# EasyEDA Pro project ProDoc_P2_2025-09-22.epro

# Schematic Schematic3
Board Name: 处理器; Create Date: 2024-10-06; Page Name: P2; Project Name: 八通道接口; Schematic Name: Schematic3; Update Date: 2024-10-06; Company: 嘉立创EDA; Page Size: B; Version: V1.0
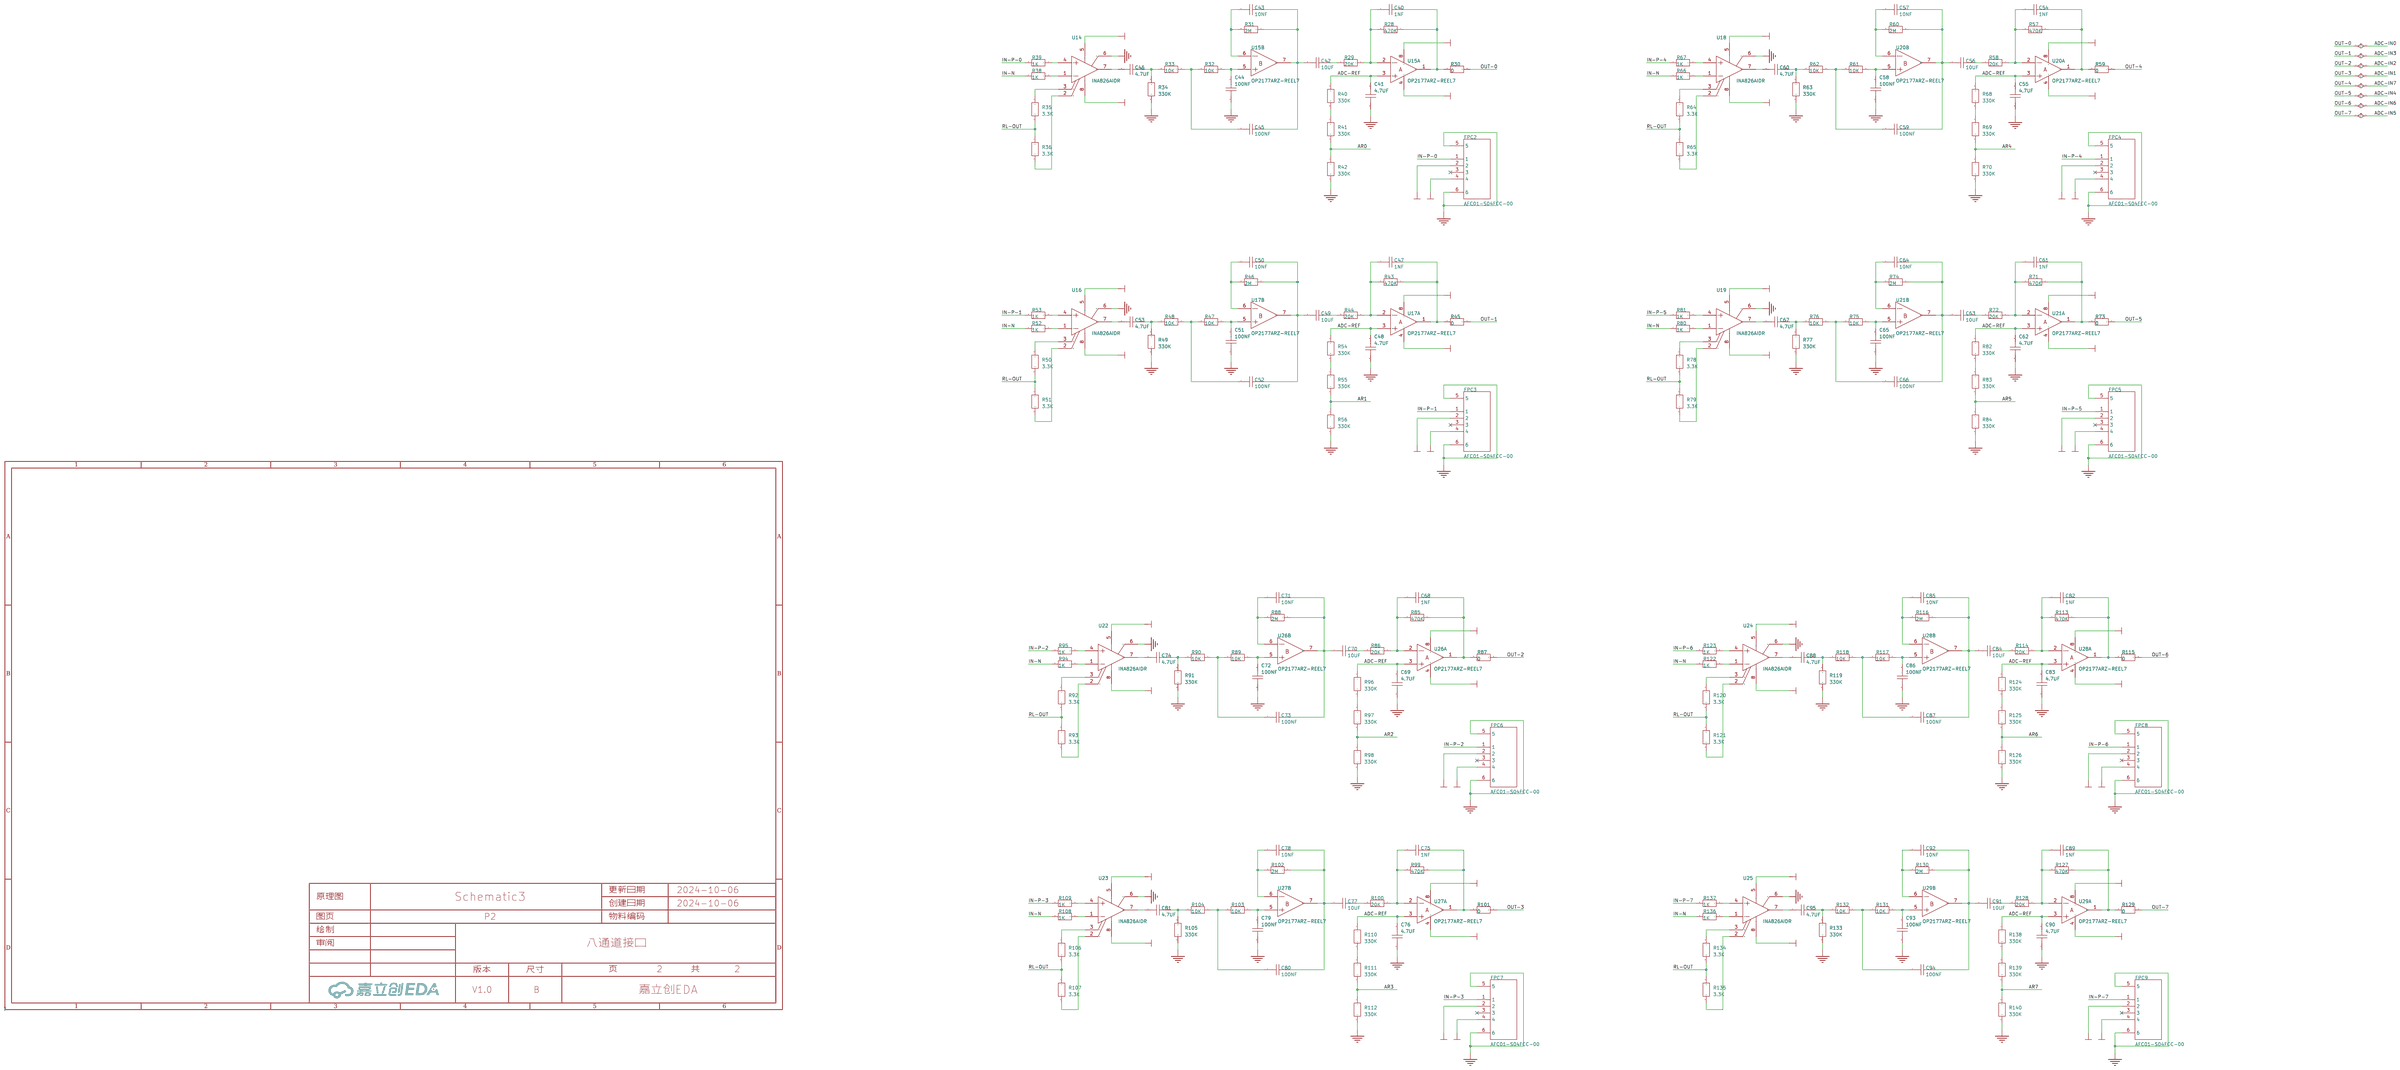
[diagram p0: schematic sheet]

## Parts
C40  1NF  [C0603]
C41  4.7UF  [C0603]
C42  10UF  [C0603]
C43  10NF  [C0603]
C44  100NF  [C0603]
C45  100NF  [C0603]
C46  4.7UF  [C0603]
C47  1NF  [C0603]
C48  4.7UF  [C0603]
C49  10UF  [C0603]
C50  10NF  [C0603]
C51  100NF  [C0603]
C52  100NF  [C0603]
C53  4.7UF  [C0603]
C54  1NF  [C0603]
C55  4.7UF  [C0603]
C56  10UF  [C0603]
C57  10NF  [C0603]
C58  100NF  [C0603]
C59  100NF  [C0603]
C60  4.7UF  [C0603]
C61  1NF  [C0603]
C62  4.7UF  [C0603]
C63  10UF  [C0603]
C64  10NF  [C0603]
C65  100NF  [C0603]
C66  100NF  [C0603]
C67  4.7UF  [C0603]
C68  1NF  [C0603]
C69  4.7UF  [C0603]
C70  10UF  [C0603]
C71  10NF  [C0603]
C72  100NF  [C0603]
C73  100NF  [C0603]
C74  4.7UF  [C0603]
C75  1NF  [C0603]
C76  4.7UF  [C0603]
C77  10UF  [C0603]
C78  10NF  [C0603]
C79  100NF  [C0603]
C80  100NF  [C0603]
C81  4.7UF  [C0603]
C82  1NF  [C0603]
C83  4.7UF  [C0603]
C84  10UF  [C0603]
C85  10NF  [C0603]
C86  100NF  [C0603]
C87  100NF  [C0603]
C88  4.7UF  [C0603]
C89  1NF  [C0603]
C90  4.7UF  [C0603]
C91  10UF  [C0603]
C92  10NF  [C0603]
C93  100NF  [C0603]
C94  100NF  [C0603]
C95  4.7UF  [C0603]
FPC2  AFC01-S04FCC-00  [FFC-SMD_4P-P0.50_AFC01-S04FCC-00]
FPC3  AFC01-S04FCC-00  [FFC-SMD_4P-P0.50_AFC01-S04FCC-00]
FPC4  AFC01-S04FCC-00  [FFC-SMD_4P-P0.50_AFC01-S04FCC-00]
FPC5  AFC01-S04FCC-00  [FFC-SMD_4P-P0.50_AFC01-S04FCC-00]
FPC6  AFC01-S04FCC-00  [FFC-SMD_4P-P0.50_AFC01-S04FCC-00]
FPC7  AFC01-S04FCC-00  [FFC-SMD_4P-P0.50_AFC01-S04FCC-00]
FPC8  AFC01-S04FCC-00  [FFC-SMD_4P-P0.50_AFC01-S04FCC-00]
FPC9  AFC01-S04FCC-00  [FFC-SMD_4P-P0.50_AFC01-S04FCC-00]
R28  470K  [R0603]
R29  20K  [R0603]
R30  0  [R0603]
R31  2M  [R0603]
R32  10K  [R0603]
R33  10K  [R0603]
R34  330K  [R0603]
R35  3.3K  [R0603]
R36  3.3K  [R0603]
R38  1K  [R0603]
R39  1K  [R0603]
R40  330K  [R0603]
R41  330K  [R0603]
R42  330K  [R0603]
R43  470K  [R0603]
R44  20K  [R0603]
R45  0  [R0603]
R46  2M  [R0603]
R47  10K  [R0603]
R48  10K  [R0603]
R49  330K  [R0603]
R50  3.3K  [R0603]
R51  3.3K  [R0603]
R52  1K  [R0603]
R53  1K  [R0603]
R54  330K  [R0603]
R55  330K  [R0603]
R56  330K  [R0603]
R57  470K  [R0603]
R58  20K  [R0603]
R59  0  [R0603]
R60  2M  [R0603]
R61  10K  [R0603]
R62  10K  [R0603]
R63  330K  [R0603]
R64  3.3K  [R0603]
R65  3.3K  [R0603]
R66  1K  [R0603]
R67  1K  [R0603]
R68  330K  [R0603]
R69  330K  [R0603]
R70  330K  [R0603]
R71  470K  [R0603]
R72  20K  [R0603]
R73  0  [R0603]
R74  2M  [R0603]
R75  10K  [R0603]
R76  10K  [R0603]
R77  330K  [R0603]
R78  3.3K  [R0603]
R79  3.3K  [R0603]
R80  1K  [R0603]
R81  1K  [R0603]
R82  330K  [R0603]
R83  330K  [R0603]
R84  330K  [R0603]
R85  470K  [R0603]
R86  20K  [R0603]
R87  0  [R0603]
R88  2M  [R0603]
R89  10K  [R0603]
R90  10K  [R0603]
R91  330K  [R0603]
R92  3.3K  [R0603]
R93  3.3K  [R0603]
R94  1K  [R0603]
R95  1K  [R0603]
R96  330K  [R0603]
R97  330K  [R0603]
R98  330K  [R0603]
R99  470K  [R0603]
R100  20K  [R0603]
R101  0  [R0603]
R102  2M  [R0603]
R103  10K  [R0603]
R104  10K  [R0603]
R105  330K  [R0603]
R106  3.3K  [R0603]
R107  3.3K  [R0603]
R108  1K  [R0603]
R109  1K  [R0603]
R110  330K  [R0603]
R111  330K  [R0603]
R112  330K  [R0603]
R113  470K  [R0603]
R114  20K  [R0603]
R115  0  [R0603]
R116  2M  [R0603]
R117  10K  [R0603]
R118  10K  [R0603]
R119  330K  [R0603]
R120  3.3K  [R0603]
R121  3.3K  [R0603]
R122  1K  [R0603]
R123  1K  [R0603]
R124  330K  [R0603]
R125  330K  [R0603]
R126  330K  [R0603]
R127  470K  [R0603]
R128  20K  [R0603]
R129  0  [R0603]
R130  2M  [R0603]
R131  10K  [R0603]
R132  10K  [R0603]
R133  330K  [R0603]
R134  3.3K  [R0603]
R135  3.3K  [R0603]
R136  1K  [R0603]
R137  1K  [R0603]
R138  330K  [R0603]
R139  330K  [R0603]
R140  330K  [R0603]
U14  INA826AIDR  [SOIC-8_L4.9-W3.9-P1.27-LS6.0-BL]
U15  OP2177ARZ-REEL7  [SOIC-8_L4.9-W3.9-P1.27-LS6.0-BL]  (sections 1,2)
U16  INA826AIDR  [SOIC-8_L4.9-W3.9-P1.27-LS6.0-BL]
U17  OP2177ARZ-REEL7  [SOIC-8_L4.9-W3.9-P1.27-LS6.0-BL]  (sections 1,2)
U18  INA826AIDR  [SOIC-8_L4.9-W3.9-P1.27-LS6.0-BL]
U19  INA826AIDR  [SOIC-8_L4.9-W3.9-P1.27-LS6.0-BL]
U20  OP2177ARZ-REEL7  [SOIC-8_L4.9-W3.9-P1.27-LS6.0-BL]  (sections 1,2)
U21  OP2177ARZ-REEL7  [SOIC-8_L4.9-W3.9-P1.27-LS6.0-BL]  (sections 1,2)
U22  INA826AIDR  [SOIC-8_L4.9-W3.9-P1.27-LS6.0-BL]
U23  INA826AIDR  [SOIC-8_L4.9-W3.9-P1.27-LS6.0-BL]
U24  INA826AIDR  [SOIC-8_L4.9-W3.9-P1.27-LS6.0-BL]
U25  INA826AIDR  [SOIC-8_L4.9-W3.9-P1.27-LS6.0-BL]
U26  OP2177ARZ-REEL7  [SOIC-8_L4.9-W3.9-P1.27-LS6.0-BL]  (sections 1,2)
U27  OP2177ARZ-REEL7  [SOIC-8_L4.9-W3.9-P1.27-LS6.0-BL]  (sections 1,2)
U28  OP2177ARZ-REEL7  [SOIC-8_L4.9-W3.9-P1.27-LS6.0-BL]  (sections 1,2)
U29  OP2177ARZ-REEL7  [SOIC-8_L4.9-W3.9-P1.27-LS6.0-BL]  (sections 1,2)

## Library data of the parts
C40-C95 = CC0402GRNPO9BN120: 容值:12pF;精度:±2%;额定电压:50V;温度系数:NP0;; LCSC Part Name: 12pF ±2% 50V; Supplier Part: C526985; Manufacturer: YAGEO(国巨); Supplier Footprint: 0402; JLCPCB Part Class: Extended Part; Datasheet: https://atta.szlcsc.com/upload/public/pdf/source/20200508/C526985_2566F49E1D94CC0AC949362F5EB10F49.pdf; Supplier: LCSC; Tolerance: ±2%; Voltage Rated: 50V; Temperature Coefficient: NP0
FPC2-FPC9 = AFC01-S04FCC-00: 锁定特性:翻盖式;触点类型:下接;触点数量:4P;间距:0.5mm;安装类型:卧贴;; LCSC Part Name: 间距:0.5mm P数:4P 翻盖式 下接; Supplier Part: C262260; Manufacturer: JS(钜硕电子); Supplier Footprint: SMD,P=0.5mm,卧贴; JLCPCB Part Class: 扩展库; Datasheet: https://atta.szlcsc.com/upload/public/pdf/source/20190816/C413942_2A72D1AC756EAE17EEDF756A339D4500.pdf; Supplier: LCSC; Locking Feature: 翻盖式; Contact Type: 下接; Number of Contacts: 4P; Pitch: 0.5mm; Mounting Type: 卧贴; FFC, FCB Thickness: 0.3mm; Height Above Board: 2mm
R28-R36 R38-R140 = FRC0603J103TS: 电阻类型:厚膜电阻;阻值:10kΩ;精度:±5%;功率:100mW;最大工作电压:75V;温度系数:±100ppm/℃;; LCSC Part Name: 10kΩ ±5% 100mW 厚膜电阻; Supplier Part: C2930027; Manufacturer: FOJAN(富捷); Supplier Footprint: 0603; JLCPCB Part Class: 扩展库; Datasheet: https://atta.szlcsc.com/upload/public/pdf/source/20211221/925EC7D7225764EE0046F22065062C87.pdf; Supplier: LCSC; Type: 厚膜电阻; Tolerance: ±5%; Power(Watts): 100mW; Overload Voltage (Max): 75V; Temperature Coefficient: ±100ppm/℃; Operating Temperature Range: -55℃~+155℃
U14 U16 U18 U19 U22-U25 = INA826AIDR: 放大器数:单路;输入偏置电流(Ib):35nA;输入失调电压(Vos):40uV;增益带宽积(GBP):-;压摆率(SR):1V/us;带宽(-3db):1MHz;轨到轨:-;; Supplier Part: C38433; Manufacturer: TI(德州仪器); Supplier Footprint: SOIC-8; JLCPCB Part Class: 扩展库; Datasheet: https://www.ti.com/cn/lit/gpn/ina826; Supplier: LCSC; Number of Circuits: 单路; Current - Input Bias(Ib): 35nA; Voltage - Input Offset(Vos): 40uV; Slew Rate(SR): 1V/us; -3db Bandwidth: 1MHz; Operating Temperature: -40℃~+125℃
U15 U17 U20 U21 U26-U29 = OP2177ARZ-REEL7: 放大器数:双路;增益带宽积(GBP):1.3MHz;输入偏置电流(Ib):500pA;压摆率(SR):0.7V/us;带宽(-3db):-;; Supplier Part: C16418; Manufacturer: ADI(亚德诺); Supplier Footprint: SOIC-8; JLCPCB Part Class: Extended Part; Datasheet: https://atta.szlcsc.com/upload/public/pdf/source/20191127/C462165_19F318AB81E396C61DC2A8E1ED8F24DD.pdf; Supplier: LCSC; Number of Circuits: 双路; Gain Bandwidth Product(GBP): 1.3MHz; Current - Input Bias(Ib): 500pA; Slew Rate(SR): 0.7V/us; Output Current: 10mA; Supply Current: 400uA; Operating Temperature: -40℃~+125℃

## Nets
AVCC: FPC2.2 FPC3.2 FPC4.2 FPC5.2 FPC6.2 FPC7.2 FPC8.2 FPC9.2 U14.8(VS+) U15.4(V-) U16.8(VS+) U17.4(V-) U18.8(VS+) U19.8(VS+) U20.4(V-) U21.4(V-) U22.8(VS+) U23.8(VS+) U24.8(VS+) U25.8(VS+) U26.4(V-) U27.4(V-) U28.4(V-) U29.4(V-)
AVEE: FPC2.4 FPC3.4 FPC4.4 FPC5.4 FPC6.4 FPC7.4 FPC8.4 FPC9.4 U14.5(VS-) U15.8(V+) U16.5(VS-) U17.8(V+) U18.5(VS-) U19.5(VS-) U20.8(V+) U21.8(V+) U22.5(VS-) U23.5(VS-) U24.5(VS-) U25.5(VS-) U26.8(V+) U27.8(V+) U28.8(V+) U29.8(V+)
GND: C41.1 C44.1 C48.1 C51.1 C55.1 C58.1 C62.1 C65.1 C69.1 C72.1 C76.1 C79.1 C83.1 C86.1 C90.1 C93.1 FPC2.5 FPC2.6 FPC3.5 FPC3.6 FPC4.5 FPC4.6 FPC5.5 FPC5.6 FPC6.5 FPC6.6 FPC7.5 FPC7.6 FPC8.5 FPC8.6 FPC9.5 FPC9.6 R34.2 R42.2 R49.2 R56.2 R63.2 R70.2 R77.2 R84.2 R91.2 R98.2 R105.2 R112.2 R119.2 R126.2 R133.2 R140.2 U14.6(REF) U16.6(REF) U18.6(REF) U19.6(REF) U22.6(REF) U23.6(REF) U24.6(REF) U25.6(REF)
ADC-IN0: R30.1
ADC-IN1: R101.1
ADC-IN2: R87.1
ADC-IN3: R45.1
ADC-IN4: R73.1
ADC-IN5: R129.1
ADC-IN6: R115.1
ADC-IN7: R59.1
ADC-REF: C41.2 C48.2 C55.2 C62.2 C69.2 C76.2 C83.2 C90.2 R40.1 R54.1 R68.1 R82.1 R96.1 R110.1 R124.1 R138.1 U15.3(+IN A) U17.3(+IN A) U20.3(+IN A) U21.3(+IN A) U26.3(+IN A) U27.3(+IN A) U28.3(+IN A) U29.3(+IN A)
AR0: R41.2 R42.1
AR1: R55.2 R56.1
AR2: R97.2 R98.1
AR3: R111.2 R112.1
AR4: R69.2 R70.1
AR5: R83.2 R84.1
AR6: R125.2 R126.1
AR7: R139.2 R140.1
IN-N: R38.2 R52.2 R66.2 R80.2 R94.2 R108.2 R122.2 R136.2
IN-P-0: FPC2.1 R39.2
IN-P-1: FPC3.1 R53.2
IN-P-2: FPC6.1 R95.2
IN-P-3: FPC7.1 R109.2
IN-P-4: FPC4.1 R67.2
IN-P-5: FPC5.1 R81.2
IN-P-6: FPC8.1 R123.2
IN-P-7: FPC9.1 R137.2
RL-OUT: R35.2 R36.1 R50.2 R51.1 R64.2 R65.1 R78.2 R79.1 R92.2 R93.1 R106.2 R107.1 R120.2 R121.1 R134.2 R135.1
Net-(C40-1): C40.1 R28.2 R29.1 U15.2(-IN A)
Net-(C40-2): C40.2 R28.1 R30.2 U15.1(OUT A)
Net-(C42-1): C42.1 C43.2 C45.2 R31.1 U15.7(OUT B)
Net-(C42-2): C42.2 R29.2
Net-(C43-1): C43.1 R31.2 U15.6(-IN B)
Net-(C44-2): C44.2 R32.1 U15.5(+IN B)
Net-(C45-1): C45.1 R32.2 R33.1
Net-(C46-1): C46.1 U14.7(VOUT)
Net-(C46-2): C46.2 R33.2 R34.1
Net-(C47-1): C47.1 R43.2 R44.1 U17.2(-IN A)
Net-(C47-2): C47.2 R43.1 R45.2 U17.1(OUT A)
Net-(C49-1): C49.1 C50.2 C52.2 R46.1 U17.7(OUT B)
Net-(C49-2): C49.2 R44.2
Net-(C50-1): C50.1 R46.2 U17.6(-IN B)
Net-(C51-2): C51.2 R47.1 U17.5(+IN B)
Net-(C52-1): C52.1 R47.2 R48.1
Net-(C53-1): C53.1 U16.7(VOUT)
Net-(C53-2): C53.2 R48.2 R49.1
Net-(C54-1): C54.1 R57.2 R58.1 U20.2(-IN A)
Net-(C54-2): C54.2 R57.1 R59.2 U20.1(OUT A)
Net-(C56-1): C56.1 C57.2 C59.2 R60.1 U20.7(OUT B)
Net-(C56-2): C56.2 R58.2
Net-(C57-1): C57.1 R60.2 U20.6(-IN B)
Net-(C58-2): C58.2 R61.1 U20.5(+IN B)
Net-(C59-1): C59.1 R61.2 R62.1
Net-(C60-1): C60.1 U18.7(VOUT)
Net-(C60-2): C60.2 R62.2 R63.1
Net-(C61-1): C61.1 R71.2 R72.1 U21.2(-IN A)
Net-(C61-2): C61.2 R71.1 R73.2 U21.1(OUT A)
Net-(C63-1): C63.1 C64.2 C66.2 R74.1 U21.7(OUT B)
Net-(C63-2): C63.2 R72.2
Net-(C64-1): C64.1 R74.2 U21.6(-IN B)
Net-(C65-2): C65.2 R75.1 U21.5(+IN B)
Net-(C66-1): C66.1 R75.2 R76.1
Net-(C67-1): C67.1 U19.7(VOUT)
Net-(C67-2): C67.2 R76.2 R77.1
Net-(C68-1): C68.1 R85.2 R86.1 U26.2(-IN A)
Net-(C68-2): C68.2 R85.1 R87.2 U26.1(OUT A)
Net-(C70-1): C70.1 C71.2 C73.2 R88.1 U26.7(OUT B)
Net-(C70-2): C70.2 R86.2
Net-(C71-1): C71.1 R88.2 U26.6(-IN B)
Net-(C72-2): C72.2 R89.1 U26.5(+IN B)
Net-(C73-1): C73.1 R89.2 R90.1
Net-(C74-1): C74.1 U22.7(VOUT)
Net-(C74-2): C74.2 R90.2 R91.1
Net-(C75-1): C75.1 R99.2 R100.1 U27.2(-IN A)
Net-(C75-2): C75.2 R99.1 R101.2 U27.1(OUT A)
Net-(C77-1): C77.1 C78.2 C80.2 R102.1 U27.7(OUT B)
Net-(C77-2): C77.2 R100.2
Net-(C78-1): C78.1 R102.2 U27.6(-IN B)
Net-(C79-2): C79.2 R103.1 U27.5(+IN B)
Net-(C80-1): C80.1 R103.2 R104.1
Net-(C81-1): C81.1 U23.7(VOUT)
Net-(C81-2): C81.2 R104.2 R105.1
Net-(C82-1): C82.1 R113.2 R114.1 U28.2(-IN A)
Net-(C82-2): C82.2 R113.1 R115.2 U28.1(OUT A)
Net-(C84-1): C84.1 C85.2 C87.2 R116.1 U28.7(OUT B)
Net-(C84-2): C84.2 R114.2
Net-(C85-1): C85.1 R116.2 U28.6(-IN B)
Net-(C86-2): C86.2 R117.1 U28.5(+IN B)
Net-(C87-1): C87.1 R117.2 R118.1
Net-(C88-1): C88.1 U24.7(VOUT)
Net-(C88-2): C88.2 R118.2 R119.1
Net-(C89-1): C89.1 R127.2 R128.1 U29.2(-IN A)
Net-(C89-2): C89.2 R127.1 R129.2 U29.1(OUT A)
Net-(C91-1): C91.1 C92.2 C94.2 R130.1 U29.7(OUT B)
Net-(C91-2): C91.2 R128.2
Net-(C92-1): C92.1 R130.2 U29.6(-IN B)
Net-(C93-2): C93.2 R131.1 U29.5(+IN B)
Net-(C94-1): C94.1 R131.2 R132.1
Net-(C95-1): C95.1 U25.7(VOUT)
Net-(C95-2): C95.2 R132.2 R133.1
Net-(R35-1): R35.1 U14.3(RG)
Net-(R36-2): R36.2 U14.2(RG)
Net-(R38-1): R38.1 U14.1(IN-)
Net-(R39-1): R39.1 U14.4(IN+)
Net-(R40-2): R40.2 R41.1
Net-(R50-1): R50.1 U16.3(RG)
Net-(R51-2): R51.2 U16.2(RG)
Net-(R52-1): R52.1 U16.1(IN-)
Net-(R53-1): R53.1 U16.4(IN+)
Net-(R54-2): R54.2 R55.1
Net-(R64-1): R64.1 U18.3(RG)
Net-(R65-2): R65.2 U18.2(RG)
Net-(R66-1): R66.1 U18.1(IN-)
Net-(R67-1): R67.1 U18.4(IN+)
Net-(R68-2): R68.2 R69.1
Net-(R78-1): R78.1 U19.3(RG)
Net-(R79-2): R79.2 U19.2(RG)
Net-(R80-1): R80.1 U19.1(IN-)
Net-(R81-1): R81.1 U19.4(IN+)
Net-(R82-2): R82.2 R83.1
Net-(R92-1): R92.1 U22.3(RG)
Net-(R93-2): R93.2 U22.2(RG)
Net-(R94-1): R94.1 U22.1(IN-)
Net-(R95-1): R95.1 U22.4(IN+)
Net-(R96-2): R96.2 R97.1
Net-(R106-1): R106.1 U23.3(RG)
Net-(R107-2): R107.2 U23.2(RG)
Net-(R108-1): R108.1 U23.1(IN-)
Net-(R109-1): R109.1 U23.4(IN+)
Net-(R110-2): R110.2 R111.1
Net-(R120-1): R120.1 U24.3(RG)
Net-(R121-2): R121.2 U24.2(RG)
Net-(R122-1): R122.1 U24.1(IN-)
Net-(R123-1): R123.1 U24.4(IN+)
Net-(R124-2): R124.2 R125.1
Net-(R134-1): R134.1 U25.3(RG)
Net-(R135-2): R135.2 U25.2(RG)
Net-(R136-1): R136.1 U25.1(IN-)
Net-(R137-1): R137.1 U25.4(IN+)
Net-(R138-2): R138.2 R139.1

Not connected (* = marked no-connect by the designer): FPC2 3*; FPC3 3*; FPC4 3*; FPC5 3*; FPC6 3*; FPC7 3*; FPC8 3*; FPC9 3*
